# EAGLE design v6smd (EAGLE 7.2.0)
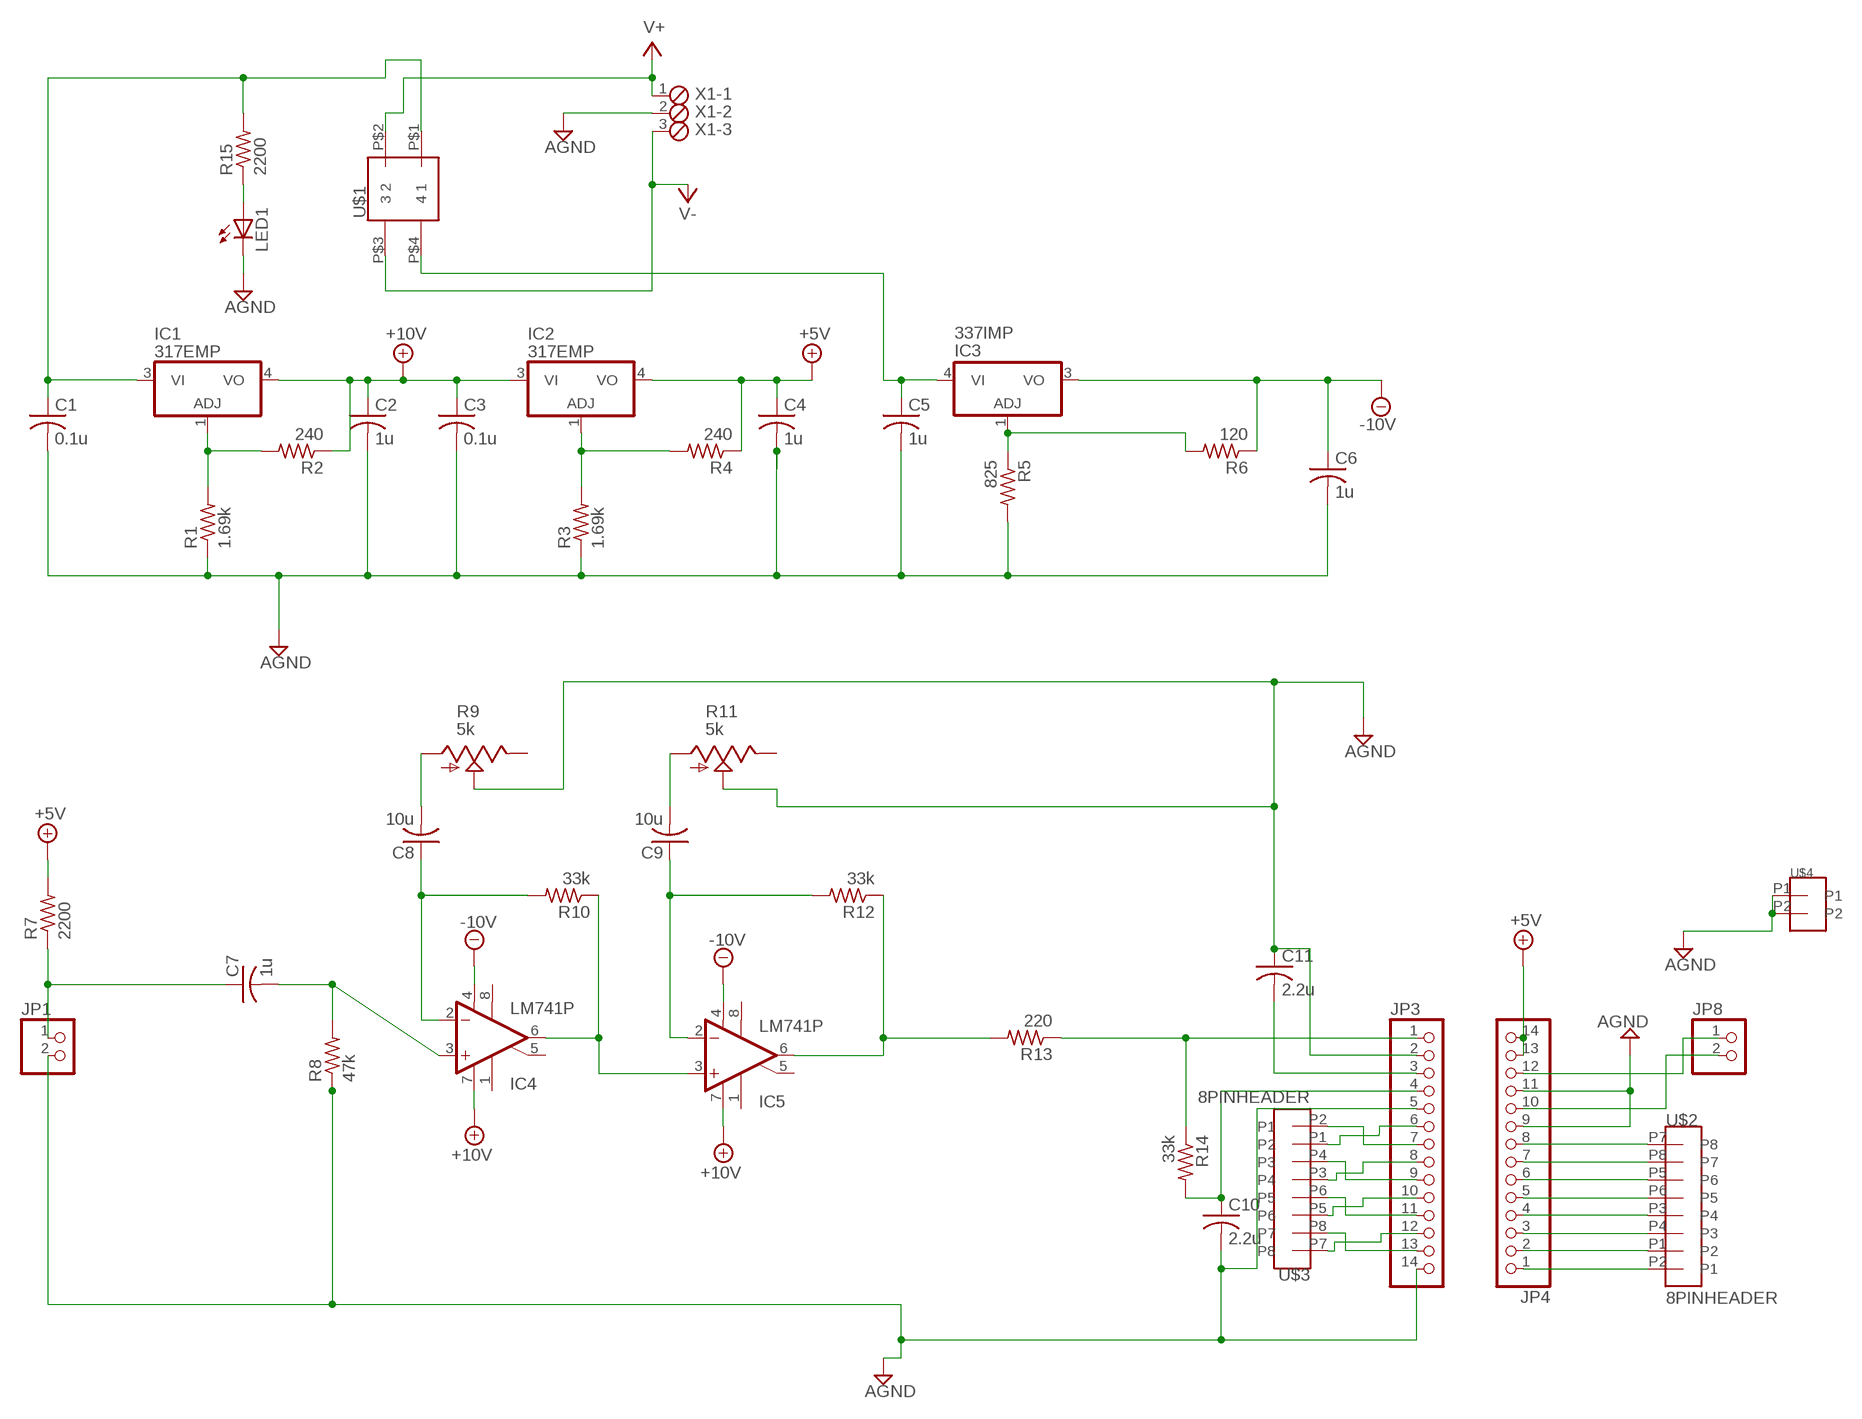
[diagram p0: schematic, sheet 1]

## Parts
C1  0.1u  C-USC1206  [C1206]
C2  1u  C-USC1206  [C1206]
C3  0.1u  C-USC1206  [C1206]
C4  1u  C-USC1206  [C1206]
C5  1u  C-USC1206  [C1206]
C6  1u  C-USC1206  [C1206]
C7  1u  C-USC1206  [C1206]
C8  10u  C-USC1206  [C1206]
C9  10u  C-USC1206  [C1206]
C10  2.2u  C-USC1206  [C1206]
C11  2.2u  C-USC1206  [C1206]
IC1  317EMP  [SOT223]
IC2  317EMP  [SOT223]
IC3  337IMP  [SOT223]
IC4  LM741P  [DIL08]
IC5  LM741P  [DIL08]
JP1  PINHD-1X2  [1X02]
JP3  PINHD-1X14  [1X14]
JP4  PINHD-1X14  [1X14]
JP8  PINHD-1X2  [1X02]
LED1  LED3MM  [LED3MM]
R1  1.69k  R-US_R2512  [R2512]
R2  240  R-US_R2512  [R2512]
R3  1.69k  R-US_R2512  [R2512]
R4  240  R-US_R2512  [R2512]
R5  825  R-US_R2512  [R2512]
R6  120  R-US_R2512  [R2512]
R7  2200  R-US_R2512  [R2512]
R8  47k  R-US_R2512  [R2512]
R9  5k  TRIM_US-B64Y  [B64Y]
R10  33k  R-US_R2512  [R2512]
R11  5k  TRIM_US-B64Y  [B64Y]
R12  33k  R-US_R2512  [R2512]
R13  220  R-US_R2512  [R2512]
R14  33k  R-US_R2512  [R2512]
R15  2200  R-US_R2512  [R2512]
U$1  S201031MS02Q  [DPST_FOOTPRINT]
U$2  8PINHEADER  [2X4HEADER]
U$3  8PINHEADER  [2X4HEADER]
U$4  2X1HEADER  [2X1HEADER]
X1  MPT3  [3POL254]

## Nets
+5V: C4.1 IC2.4(VO) JP4.13 JP4.14 R4.1 R7.2
+10V: C2.1 C3.1 IC1.4(VO) IC2.3(VI) IC4.7(V+) IC5.7(V+) R2.1
-10V: C6.1 IC3.3(VO) IC4.4(V-) IC5.4(V-) R6.1
AGND: C1.2 C2.2 C3.2 C4.2 C5.2 C6.2 C10.2 C11.1 JP1.2 JP3.2 JP3.5 JP3.14 JP4.9 JP4.11 LED1.K(C) R1.1 R3.1 R5.2 R8.1 R9.S R11.S U$4.P1 U$4.P2 X1.2
N$1: IC4.6(OUT) IC5.3(+IN) R10.1
N$2: C7.1 JP1.1 R7.1
N$3: C7.2 IC4.3(+IN) R8.2
N$4: C8.1 IC4.2(-IN) R10.2
N$5: IC5.6(OUT) R12.1 R13.2
N$6: C9.1 IC5.2(-IN) R12.2
N$7: JP3.1 R13.1 R14.1
N$8: IC1.1(ADJ) R1.2 R2.2
N$9: IC2.1(ADJ) R3.2 R4.2
N$10: IC3.1(ADJ) R5.1 R6.2
N$11: C8.2 R9.A
N$12: JP4.1 U$2.P2(P1)
N$13: JP4.2 U$2.P1(P2)
N$14: C9.2 R11.A
N$15: C11.2 JP3.3
N$16: C10.1 JP3.4 R14.2
N$17: JP4.3 U$2.P4(P3)
N$18: JP4.4 U$2.P3(P4)
N$19: JP4.5 U$2.P6(P5)
N$20: JP4.6 U$2.P5(P6)
N$21: JP4.7 U$2.P8(P7)
N$22: JP4.8 U$2.P7(P8)
N$23: JP3.7 U$3.P2(P1)
N$24: JP3.6 U$3.P1(P2)
N$25: JP3.12 U$3.P7(P8)
N$26: JP3.13 U$3.P8(P7)
N$27: JP3.11 U$3.P6(P5)
N$28: JP3.9 U$3.P4(P3)
N$29: JP3.10 U$3.P5(P6)
N$30: JP3.8 U$3.P3(P4)
N$31: JP4.12 JP8.1
N$32: JP4.10 JP8.2
N$43: C1.1 IC1.3(VI) R15.2 U$1.P$1
N$44: C5.1 IC3.4(VI) U$1.P$4
N$45: LED1.A R15.1
V+: U$1.P$2 X1.1
V-: U$1.P$3 X1.3
Unconnected: IC4.1(ON1) IC4.5(ON2) IC4.8(OPT) IC5.1(ON1) IC5.5(ON2) IC5.8(OPT) R9.E R11.E

## Library data of the parts
C1-C11 = rcl:C-US: CAPACITOR, American symbol
IC1 IC2 = linear:*317: Positive VOLTAGE REGULATOR
IC3 = linear:*337: Negative VOLTAGE REGULATOR
IC4 IC5 = linear:*741: OP AMP
JP1 JP8 = pinhead:PINHD-1X2: PIN HEADER
JP3 JP4 = pinhead:PINHD-1X14: PIN HEADER
LED1 = led:LED: LED OSRAM: - CHIPLED LG R971, LG N971, LY N971, LG Q971, LY Q971, LO R971, LY R971 LH N974, LH R974 LS Q976, LO Q976, LY Q976 LO Q996 - Hyper CHIPLED LW Q18S LB Q993, LB Q99A, LB R99A - SideLED LS A670, LO A670, LY A670, LG A670, LP A670 LB A673, LV A673, LT A673, LW A673 LH A674 LY A675 LS A676, LA A676, LO A676, LY A676, LW A676 LS A679, LY A679, LG A679 - Hyper Micro SIDELED® LS Y876, LA Y876, LO Y876, LY Y876 LT Y87S - SmartLED LW L88C, LW L88S LB L89C, LB L89S, LG L890 LS L89K, LO L89K, LY L89K LS L896, LA L896, LO L896, LY L896 - TOPLED LS T670, LO T670, LY T670, LG T670, LP T670 LSG T670, LSP T670, LSY T670, LOP T670, LYG T670 LG T671, LOG T671, LSG T671 LB T673, LV T673, LT T673, LW T673 LH T674 LS T676, LA T676, LO T676, LY T676, LB T676, LH T676, LSB T676, LW T676 LB T67C, LV T67C, LT T67C, LS T67K, LO T67K, LY T67K, LW E67C LS E67B, LA E67B, LO E67B, LY E67B, LB E67C, LV E67C, LT E67C LW T67C LS T679, LY T679, LG T679 LS T770, LO T770, LY T770, LG T770, LP T770 LB T773, LV T773, LT T773, LW T773 LH T774 LS E675, LA E675, LY E675, LS T675 LS T776, LA T776, LO T776, LY T776, LB T776 LHGB T686 LT T68C, LB T68C - Hyper Mini TOPLED® LB M676 - Mini TOPLED Santana® LG M470 LS M47K, LO M47K, LY M47K Source: http://www.osram.convergy.de LUXEON: - LUMILED® LXK2-PW12-R00, LXK2-PW12-S00, LXK2-PW14-U00, LXK2-PW14-V00 LXK2-PM12-R00, LXK2-PM12-S00, LXK2-PM14-U00 LXK2-PE12-Q00, LXK2-PE12-R00, LXK2-PE12-S00, LXK2-PE14-T00, LXK2-PE14-U00 LXK2-PB12-K00, LXK2-PB12-L00, LXK2-PB12-M00, LXK2-PB14-N00, LXK2-PB14-P00, LXK2-PB14-Q00 LXK2-PR12-L00, LXK2-PR12-M00, LXK2-PR14-Q00, LXK2-PR14-R00 LXK2-PD12-Q00, LXK2-PD12-R00, LXK2-PD12-S00 LXK2-PH12-R00, LXK2-PH12-S00 LXK2-PL12-P00, LXK2-PL12-Q00, LXK2-PL12-R00 Source: www.luxeon.com KINGBRIGHT: KA-3528ASYC Source: www.kingbright.com
R1-R8 R10 R12-R15 = rcl:R-US_: RESISTOR, American symbol
R9 R11 = pot:TRIM_US-: POTENTIOMETER
U$1 = mylib:S201031MS02Q
U$2 U$3 = mylib:8PINHEADER
U$4 = mylib:2X1HEADER
X1 = con-phoenix-254:MPT3: PHOENIX CONNECTOR; OC_FARNELL: unknown; OC_NEWARK: unknown

## Net classes
0 default: clearance 0.205 mm

## Board
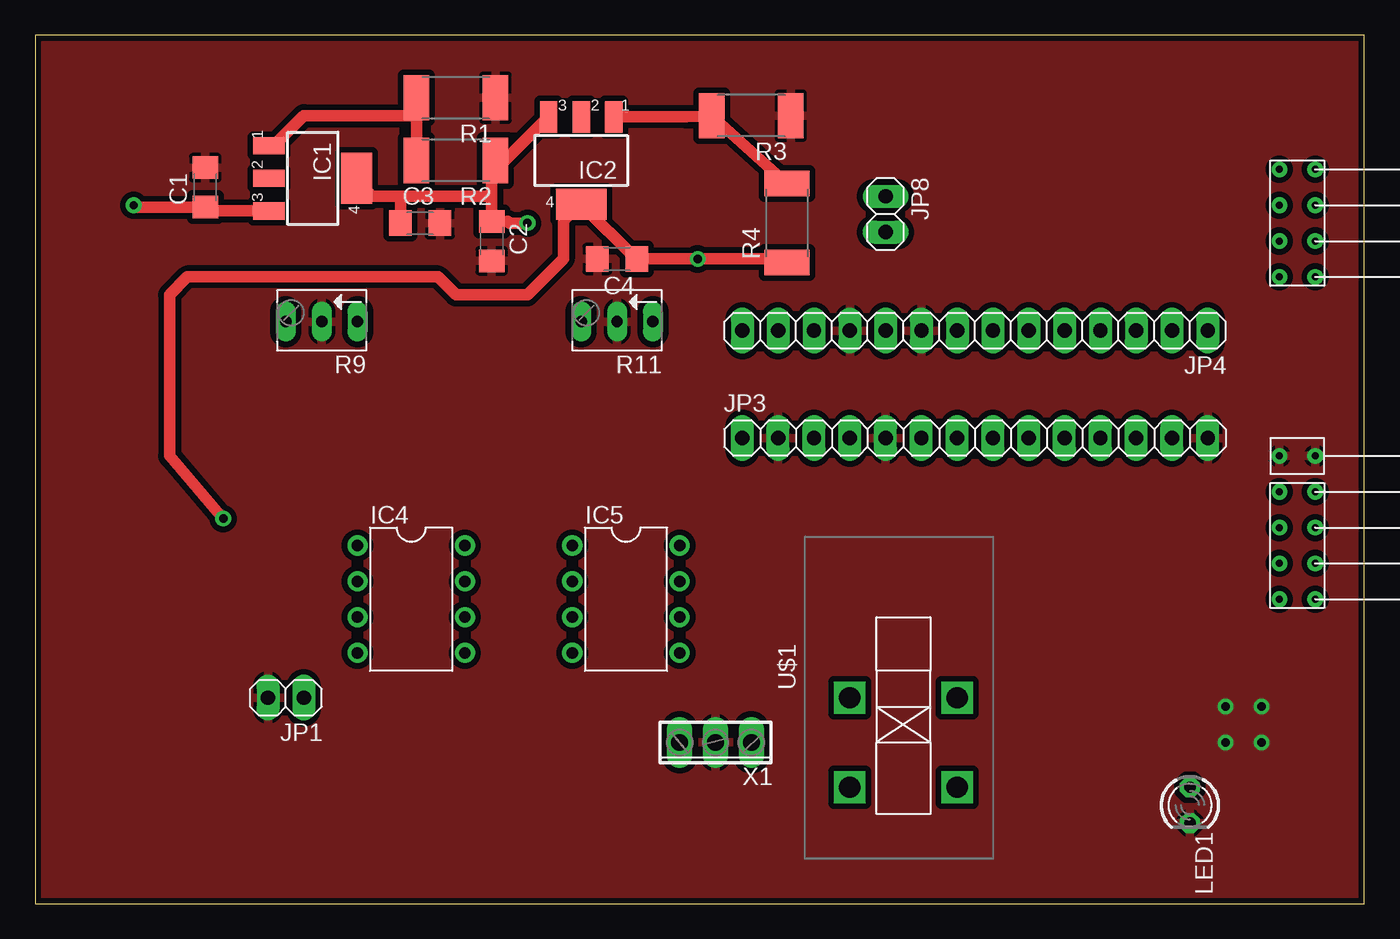
[diagram p1: board, top side]
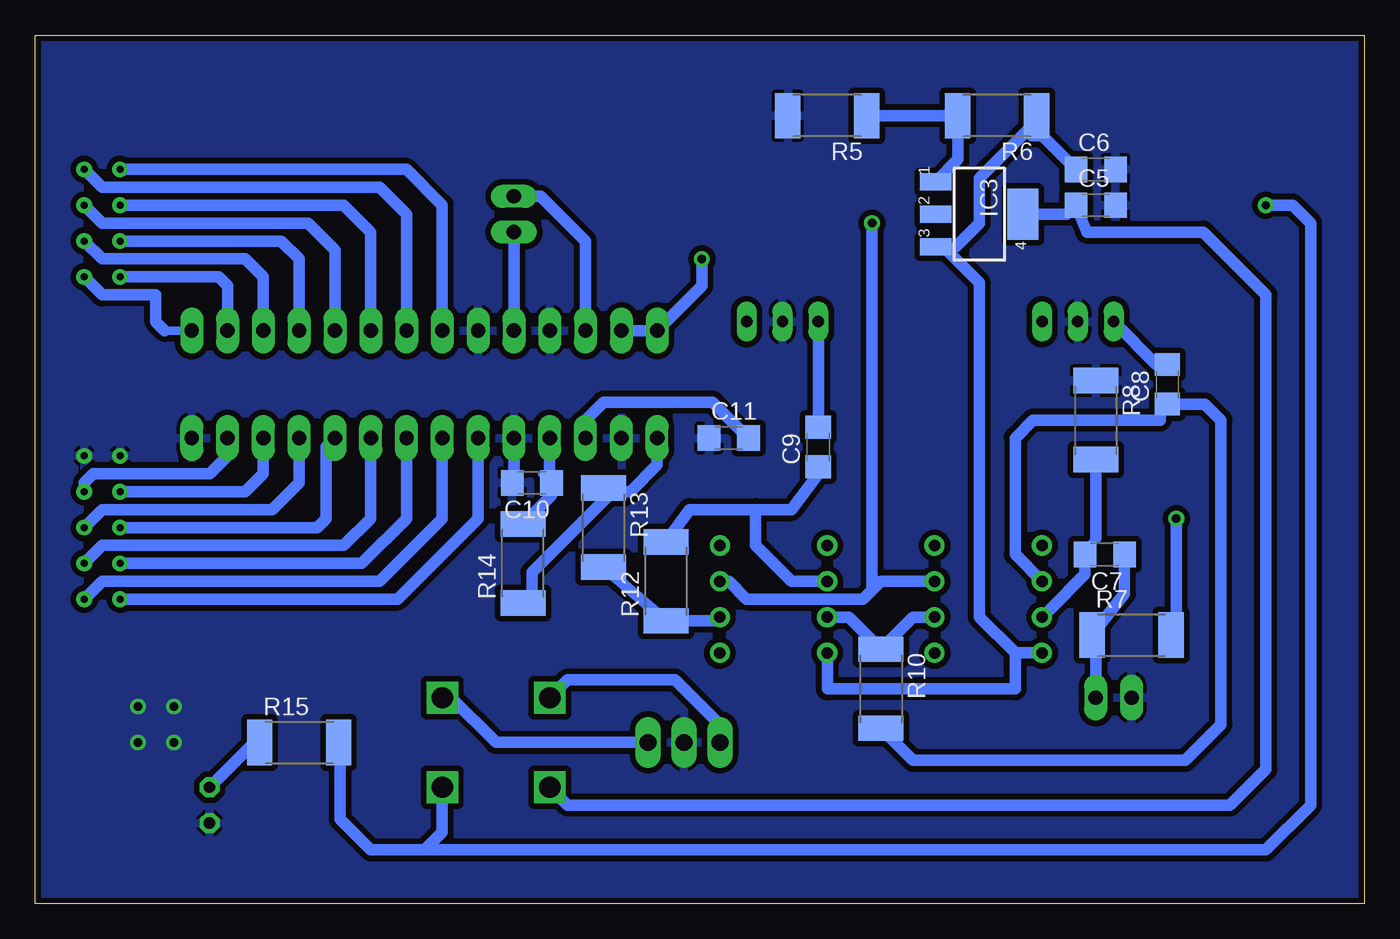
[diagram p2: board, bottom side, seen from below]

Size 94.28 x 61.59 mm. Coordinates in mm from the lower left corner, seen from the top.
Outline: 0,0 94.28,0 94.28,61.59 0,61.59 0,0
Copper layers (1*16): Top 0.035mm / dielectric 1.5mm / Bottom 0.035mm
Design rules "SparkFun": minimum track width 8mil, minimum drill 20mil, track to track 8mil, track to pad 8mil, pad to pad 8mil, via to via 8mil, smd to smd 8mil, copper to edge 10mil, drill to drill 8mil, minimum pad ring 12mil, minimum via ring 10mil, stop-mask expansion 4mil, vias tented up to drill 25mil, thermal gap 10mil

### Footprints (pad centres in the part's own frame; a part is rotated, then mirrored left to right if it is on the bottom)
C1206 = smd 1.6 x 1.8: 1 -1.4,0; 2 1.4,0
SOT223 = smd 1.219 x 2.235: 1 -2.311,-3.099; 2 0,-3.099; 3 2.311,-3.099 | smd 3.6 x 2.2: 4 0,3.099
DIL08 = drill 0.813 pad 1.27: 1 -3.81,-3.81; 2 -1.27,-3.81; 3 1.27,-3.81; 4 3.81,-3.81; 5 3.81,3.81; 6 1.27,3.81; 7 -1.27,3.81; 8 -3.81,3.81
1X02 = drill 1.016 long: 1 -1.27,0; 2 1.27,0
1X14 = drill 1.016 long: 1 -16.51,0; 2 -13.97,0; 3 -11.43,0; 4 -8.89,0; 5 -6.35,0; 6 -3.81,0; 7 -1.27,0; 8 1.27,0; 9 3.81,0; 10 6.35,0; 11 8.89,0; 12 11.43,0; 13 13.97,0; 14 16.51,0
LED3MM = drill 0.813 octagon: A -1.27,0; K 1.27,0
R2512 = smd 1.8 x 3.2: 1 -2.8,0; 2 2.8,0
B64Y = drill 0.813 long: A 2.54,0; E -2.54,0; S 0,0
DPST_FOOTPRINT = drill 1.5 square: P$1 0,5.08; P$2 -6.35,5.08; P$3 -6.35,-2.54; P$4 0,-2.54
2X4HEADER = drill 0.5: P1 0,2.54; P2 2.54,2.54; P3 0,5.08; P4 2.54,5.08; P5 0,7.62; P6 2.54,7.62; P7 0,10.16; P8 2.54,10.16
2X1HEADER = drill 0.5: P1 0,2.54; P2 2.54,2.54
3POL254 = drill 1.2 long: 1 -2.54,0; 2 0,0; 3 2.54,0

### Placement (x,y rotation side)
C1  12.06,50.8 90 top
C2  32.38,46.99 270 top
C3  27.3,48.26 0 top
C4  41.27,45.72 180 top
C5  19.05,49.53 0 bottom
C6  19.05,52.07 0 bottom
C7  18.41,24.77 180 bottom
C8  13.97,36.83 90 bottom
C9  38.73,32.38 90 bottom
C10  59.05,29.84 180 bottom
C11  45.09,33.02 0 bottom
IC1  19.68,51.44 270 top
IC2  38.73,52.7 180 top
IC3  27.3,48.9 270 bottom
IC4  26.67,21.59 270 top
IC5  41.91,21.59 270 top
JP1  17.78,14.61 180 top
JP3  66.67,33.02 0 top
JP4  66.67,40.64 180 top
JP8  60.33,48.9 270 top
LED1  81.92,6.99 270 top
R1  29.84,57.15 180 top
R2  29.84,52.7 180 top
R3  50.8,55.88 180 top
R4  53.34,48.26 90 top
R5  38.1,55.88 180 bottom
R6  26.04,55.88 180 bottom
R7  16.51,19.05 0 bottom
R8  19.05,34.29 270 bottom
R9  20.32,41.27 180 top
R10  34.29,15.24 270 bottom
R11  41.27,41.27 180 top
R12  49.53,22.86 90 bottom
R13  53.98,26.67 270 bottom
R14  59.69,24.13 90 bottom
R15  75.56,11.43 0 bottom
U$1  60.33,8.26 270 top
U$2  88.27,41.91 0 top
U$3  88.27,19.05 0 top
U$4  88.27,29.21 0 top
X1  48.26,11.43 180 top

### Tracks (layer width: path | path; a pad name or v marks a point on that pad's centre or on a via)
+5V  (via drill 0.6)
  Top 0.61: 42.62,45.72 C4.1 | IC2.4 37.47,48.34
  Top 0.813: IC2.4 42.62,45.72 | 37.47,48.34 37.47,45.72 34.92,43.18 29.84,43.18 28.57,44.45 10.79,44.45 9.53,43.18 9.53,31.75 v13.34,27.3 | R4.1 53.08,45.72 v46.99,45.72 C4.1
  Bottom 0.61: R7.2 13.34,20.7
  Bottom 0.813: JP4.13 JP4.14 46.99,43.81 v46.99,45.72 | 13.34,20.7 v13.34,27.3
+10V  (via drill 0.6)
  Top 0.61: 32.69,52.07 R2.1 32.38,51.81 | C2.1 33.52,48.39 | IC1.4 23.79,50.42 23.79,50.16
  Top 0.813: IC2.3 32.69,52.07 | 32.38,51.81 32.38,50.16 | 32.38,50.16 C2.1 | 23.79,50.16 26.04,50.16 | 26.04,50.16 32.38,50.16 | 26.04,50.16 25.91,50.03 C3.1 | 33.52,48.39 33.66,48.26 v34.92,48.26
  Bottom 0.406: 45.09,22.86 IC5.7
  Bottom 0.813: 45.09,22.86 43.81,21.59 35.56,21.59 34.92,22.23 | IC4.7 34.29,22.86 34.92,22.23 | v34.92,48.26 34.92,22.23
-10V
  Bottom 0.61: R6.1 23.36,55.38 23.62,54.37 22.75,54.37 | IC3.3 29.84,46.58 28.98,46.58
  Bottom 0.813: 22.75,54.37 C6.1 | 28.98,46.58 27.3,48.26 27.3,51.44 23.36,55.38 | 29.84,46.58 27.3,44.04 27.3,20.32 24.77,17.78 | IC4.4 24.77,17.78 | 24.77,17.78 24.77,15.24 38.1,15.24 IC5.4
AGND  (via drill 0.6)
  Bottom 0.406: 60.33,30.61 C10.2
  Bottom 0.813: JP3.5 60.33,30.61
  other vias: 84.45,13.97 87,13.97 84.45,11.43 87,11.43
  pour Top (isolate 0.406): 0.64,60.96 0.64,0 93.98,0 94.61,60.96
  pour Bottom (isolate 0.406): 0,61.59 0,0 95.25,0 95.25,61.59
N$1
  Bottom 0.61: R10.1 34.92,18.68
  Bottom 0.813: IC4.6 32.01,20.32 R10.1 36.57,20.32 IC5.3
N$2
  Bottom 0.61: R7.1 19.05,18.79
  Bottom 0.813: R7.1 17.02,21.98 C7.1 | 19.05,18.79 JP1.1
N$3
  Bottom 0.406: IC4.3 22.36,20.32 22.36,20.82
  Bottom 0.61: C7.2 19.05,25.91
  Bottom 0.813: 19.05,25.91 R8.2 | C7.2 19.82,23.36 22.36,20.82
N$4
  Bottom 0.61: C8.1 14.47,34.29
  Bottom 0.813: R10.2 32.01,10.16 12.7,10.16 10.16,12.7 10.16,34.29 11.3,35.43 C8.1 | IC4.2 24.77,24.77 24.77,33.02 23.5,34.29 14.47,34.29
N$5
  Bottom 0.406: 45.98,20.06 IC5.6
  Bottom 0.813: R13.2 R12.1 45.98,20.06
N$6
  Bottom 0.813: C9.1 38.73,30.48 40.64,27.94 43.18,27.94 | R12.2 47.88,27.94 43.18,27.94 | IC5.2 40.64,22.86 43.18,25.4 43.18,27.94
N$7
  Bottom 0.813: JP3.1 50.16,31.11 52.07,29.21 53.72,29.21 | 53.72,29.21 R13.1 | 53.72,29.21 53.72,28.84 59.05,23.5 59.05,21.96 R14.1
N$8
  Top 0.61: 16.92,53.75 IC1.1
  Top 0.813: R1.2 27.05,55.88 | 27.05,55.88 R2.2 | 16.92,53.75 19.05,55.88 27.05,55.88
N$9
  Top 0.61: 48.26,55.62 R3.2
  Top 0.813: R3.2 46.17,55.8 IC2.1 | R4.2 48.26,55.62
N$10
  Bottom 0.813: R5.1 R6.2 28.84,52.77 IC3.1
N$11
  Bottom 0.61: C8.2 14.73,38.23
  Bottom 0.813: 14.73,38.23 R9.A
N$12
  Bottom 0.61: JP4.1 85.09,40.64
  Bottom 0.813: U$2.P2 89.53,43.18 85.72,43.18 85.72,41.27 85.09,40.64
N$13
  Bottom 0.813: U$2.P1 81.28,44.45 80.64,43.81 JP4.2
N$14
  Bottom 0.813: R11.A C9.2
N$15
  Bottom 0.813: C11.2 46.23,35.56 53.98,35.56 55.24,34.29 JP3.3
N$16
  Bottom 0.406: C10.1 58.04,30.15 58.29,30.35 58.42,30.48
  Bottom 0.813: 58.42,27.57 R14.2 57.66,28.96 C10.1 | JP3.4 57.78,30.41 58.04,30.15
N$17
  Bottom 0.813: U$2.P4 89.53,45.72 79.38,45.72 78.11,44.45 JP4.3
N$18
  Bottom 0.813: U$2.P3 76.83,46.99 75.56,45.72 JP4.4
N$19
  Bottom 0.813: U$2.P6 89.53,48.26 74.93,48.26 73.03,46.35 JP4.5
N$20
  Bottom 0.813: U$2.P5 72.39,49.53 70.48,47.62 JP4.6
N$21
  Bottom 0.813: U$2.P8 89.53,50.8 69.85,50.8 67.94,48.9 JP4.7
N$22
  Bottom 0.813: U$2.P7 67.94,52.07 65.41,49.53 JP4.8
N$23
  Bottom 0.813: U$3.P2 89.53,22.86 69.85,22.86 65.41,27.3 JP3.7
N$24
  Bottom 0.813: U$3.P1 68.58,21.59 62.87,27.3 JP3.6
N$25
  Bottom 0.813: U$3.P7 79.38,29.21 78.11,30.48 JP3.12
N$26
  Bottom 0.406: JP3.13 80.64,31.75
  Bottom 0.813: U$3.P8 90.81,29.84 90.17,30.48 81.92,30.48 80.64,31.75
N$27
  Bottom 0.813: U$3.P6 89.53,27.94 77.47,27.94 75.56,29.84 JP3.11
N$28
  Bottom 0.813: U$3.P4 89.53,25.4 72.39,25.4 70.48,27.3 JP3.9
N$29
  Bottom 0.406: 73.66,32.38 JP3.10
  Bottom 0.813: U$3.P5 74.3,26.67 73.66,27.3 73.66,32.38
N$30
  Bottom 0.813: U$3.P3 71.12,24.13 67.94,27.3 JP3.8
N$31
  Bottom 0.813: JP4.12 55.24,46.99 58.42,50.16 JP8.1
N$32
  Bottom 0.813: JP4.10 JP8.2
N$43  (via drill 0.6)
  Top 0.61: C1.1 12.34,49.12 | v6.99,49.53 7.12,49.4
  Top 0.813: 12.34,49.12 IC1.3 | 7.12,49.4 C1.1
  Bottom 0.61: 72.65,11.05 73.03,11.43 R15.2 72.77,12.44 73.03,12.06
  Bottom 0.813: 72.65,11.05 72.65,5.97 70.48,3.81 66.67,3.81 | 66.67,3.81 6.99,3.81 3.81,6.99 3.81,48.26 5.08,49.53 v6.99,49.53 | U$1.P$1 65.41,5.08 66.67,3.81
N$44
  Bottom 0.61: C5.1 21.09,48.9
  Bottom 0.813: C5.1 19.68,47.62 11.43,47.62 6.99,43.18 6.99,9.53 9.53,6.99 56.52,6.99 U$1.P$4 | 21.09,48.9 IC3.4
N$45
  Bottom 0.61: R15.1 78.36,11.8
  Bottom 0.813: 78.36,11.8 LED1.A
V+
  Bottom 0.813: U$1.P$2 64.77,14.61 61.59,11.43 X1.1
V-
  Bottom 0.813: U$1.P$3 56.52,15.88 48.9,15.88 45.72,12.7 X1.3